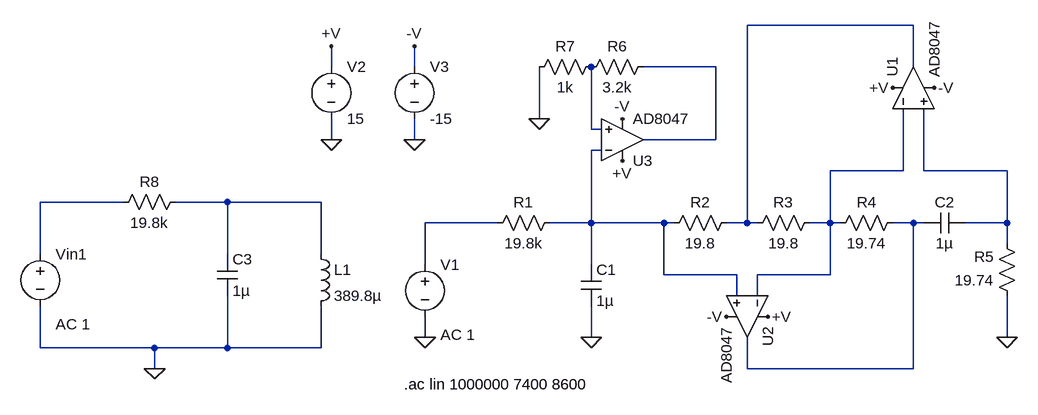
[diagram p0: schematic FILTRO - RLC - Comparativo.asc]
FILTRO - RLC - Comparativo.asc, the LTspice schematic file:
Version 4
SHEET 1 1608 808
WIRE 1056 -96 800 -96
WIRE 160 -32 160 -64
WIRE 288 -32 288 -64
WIRE 752 -32 640 -32
WIRE 1056 -32 1056 -96
WIRE 480 48 480 -32
WIRE 560 64 560 -32
WIRE 576 64 560 64
WIRE 160 80 160 48
WIRE 288 80 288 48
WIRE 752 80 752 -32
WIRE 752 80 640 80
WIRE 576 96 560 96
WIRE 1040 128 1040 32
WIRE 1040 128 928 128
WIRE 1072 128 1072 32
WIRE 1200 128 1072 128
WIRE -160 176 -288 176
WIRE 0 176 -80 176
WIRE 144 176 0 176
WIRE 416 208 304 208
WIRE 560 208 560 96
WIRE 560 208 496 208
WIRE 672 208 560 208
WIRE 688 208 672 208
WIRE 800 208 800 -96
WIRE 800 208 768 208
WIRE 816 208 800 208
WIRE 928 208 928 128
WIRE 928 208 896 208
WIRE 944 208 928 208
WIRE 1056 208 1024 208
WIRE 1072 208 1056 208
WIRE 1200 208 1200 128
WIRE 1200 208 1136 208
WIRE 1200 240 1200 208
WIRE -288 256 -288 176
WIRE 0 256 0 176
WIRE 144 256 144 176
WIRE 304 272 304 208
WIRE 560 272 560 208
WIRE 672 288 672 208
WIRE 784 288 672 288
WIRE 928 288 928 208
WIRE 928 288 816 288
WIRE 784 320 784 288
WIRE 816 320 816 288
WIRE 304 384 304 352
WIRE 560 384 560 336
WIRE 1200 384 1200 320
WIRE -288 400 -288 336
WIRE -112 400 -288 400
WIRE 0 400 0 320
WIRE 0 400 -112 400
WIRE 144 400 144 336
WIRE 144 400 0 400
WIRE -112 432 -112 400
WIRE 800 432 800 384
WIRE 1056 432 1056 208
WIRE 1056 432 800 432
FLAG 288 80 0
FLAG 160 80 0
FLAG 288 -64 -V
FLAG 160 -64 +V
FLAG 304 384 0
FLAG 560 384 0
FLAG 1200 384 0
FLAG 1088 0 -V
FLAG 768 352 -V
FLAG 1024 0 +V
FLAG 832 352 +V
FLAG 480 48 0
FLAG 608 112 +V
FLAG 608 48 -V
FLAG -112 432 0
SYMBOL voltage 160 -48 R0
WINDOW 123 0 0 Left 2
WINDOW 39 0 0 Left 2
SYMATTR InstName V2
SYMATTR Value 15
SYMBOL voltage 288 -48 R0
WINDOW 123 0 0 Left 2
WINDOW 39 0 0 Left 2
SYMATTR InstName V3
SYMATTR Value -15
SYMBOL voltage 304 256 R0
WINDOW 123 24 124 Left 2
WINDOW 39 0 0 Left 2
SYMATTR Value2 AC 1
SYMATTR InstName V1
SYMATTR Value ""
SYMBOL res 512 192 R90
WINDOW 0 0 56 VBottom 2
WINDOW 3 32 56 VTop 2
SYMATTR InstName R1
SYMATTR Value 19.8k
SYMBOL res 784 192 R90
WINDOW 0 0 56 VBottom 2
WINDOW 3 32 56 VTop 2
SYMATTR InstName R2
SYMATTR Value 19.8
SYMBOL cap 544 272 R0
SYMATTR InstName C1
SYMATTR Value 1µ
SYMBOL cap 1136 192 R90
WINDOW 0 0 32 VBottom 2
WINDOW 3 32 32 VTop 2
SYMATTR InstName C2
SYMATTR Value 1µ
SYMBOL res 912 192 R90
WINDOW 0 0 56 VBottom 2
WINDOW 3 32 56 VTop 2
SYMATTR InstName R3
SYMATTR Value 19.8
SYMBOL res 1040 192 R90
WINDOW 0 0 56 VBottom 2
WINDOW 3 32 56 VTop 2
SYMATTR InstName R4
SYMATTR Value 19.74
SYMBOL res 1216 336 R180
WINDOW 0 36 76 Left 2
WINDOW 3 36 40 Left 2
SYMATTR InstName R5
SYMATTR Value 19.74
SYMBOL Opamps\\AD8047 992 0 R270
SYMATTR InstName U1
SYMBOL Opamps\\AD8047 864 352 R90
SYMATTR InstName U2
SYMBOL Opamps\\AD8047 608 144 M180
SYMATTR InstName U3
SYMBOL res 656 -48 R90
WINDOW 0 0 56 VBottom 2
WINDOW 3 32 56 VTop 2
SYMATTR InstName R6
SYMATTR Value 3.2k
SYMBOL res 576 -48 R90
WINDOW 0 0 56 VBottom 2
WINDOW 3 32 56 VTop 2
SYMATTR InstName R7
SYMATTR Value 1k
SYMBOL res -64 160 R90
WINDOW 0 0 56 VBottom 2
WINDOW 3 32 56 VTop 2
SYMATTR InstName R8
SYMATTR Value 19.8k
SYMATTR SpiceLine tol=10
SYMBOL cap -16 256 R0
SYMATTR InstName C3
SYMATTR Value 1µ
SYMBOL ind 128 240 R0
SYMATTR InstName L1
SYMATTR Value 389.8µ
SYMBOL voltage -288 240 R0
WINDOW 123 24 124 Left 2
WINDOW 39 0 0 Left 2
SYMATTR Value2 AC 1
SYMATTR InstName Vin1
SYMATTR Value ""
TEXT 272 456 Left 2 !.ac lin 1000000 7400 8600

The netlist it stands for:
* FILTRO - RLC - Comparativo.asc
V2 +V 0 15
V3 -V 0 -15
V1 N009 0 AC 1
R1 N004 N009 19.8k
R2 N001 N004 19.8
C1 N004 0 1µ
C2 N006 N010 1µ
R3 N005 N001 19.8
R4 N010 N005 19.74
R5 0 N006 19.74
XU1 N006 N005 +V -V N001 AD8047  ; pins In+ In- V+ V- OUT
XU2 N004 N005 +V -V N010 AD8047  ; pins In+ In- V+ V- OUT
XU3 N003 N004 +V -V N002 AD8047  ; pins In+ In- V+ V- OUT
R6 N002 N003 3.2k
R7 N003 0 1k
R8 N008 N007 19.8k tol=10
C3 N008 0 1µ
L1 N008 0 389.8µ
Vin1 N007 0 AC 1
.ac lin 1000000 7400 8600
.backanno
.end